# EAGLE design UI_breakout_slim (EAGLE 6.6.0)
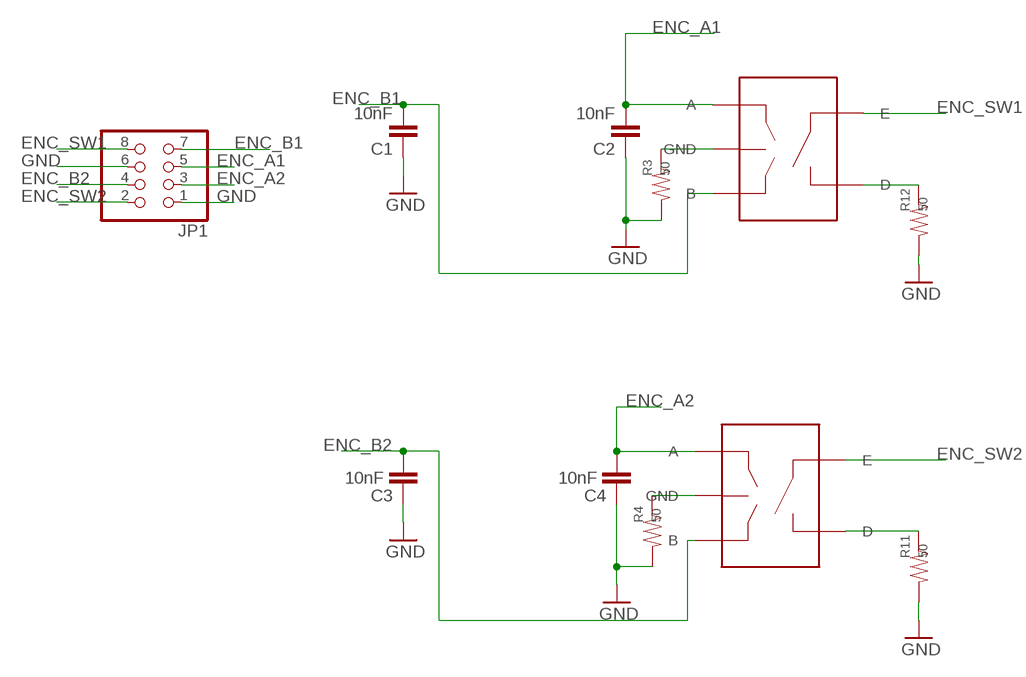
[diagram p0: schematic, sheet 1]

## Parts
C1  10nF  C-EUC0603  [C0603]
C2  10nF  C-EUC0603  [C0603]
C3  10nF  C-EUC0603  [C0603]
C4  10nF  C-EUC0603  [C0603]
ENC1  PEC09  [PEC092320FS]
ENC2  PEC09  [PEC092320FS]
JP1  PINHD-2X4-SHROUD  [ML08]
R3  50  RES0603  [0603]
R4  50  RES0603  [0603]
R11  50  RES0603  [0603]
R12  50  RES0603  [0603]

## Nets
C: ENC2.C(GND) R4.2
ENC_A1: C2.2 ENC1.A JP1.5
ENC_A2: C4.2 ENC2.A JP1.3
ENC_B1: C1.2 ENC1.B JP1.7
ENC_B2: C3.2 ENC2.B JP1.4
ENC_SW1: ENC1.E JP1.8
ENC_SW2: ENC2.E JP1.2
GND: C1.1 C2.1 C3.1 C4.1 JP1.1 JP1.6 R3.1 R4.1 R11.1 R12.1
N$3: ENC1.C(GND) R3.2
N$4: ENC2.D R11.2
N$5: ENC1.D R12.2

## Notes on the sheet
- ENC_A1
- ENC_B1
- ENC_SW1
- ENC_A2
- ENC_B2
- ENC_SW2

## Library data of the parts
C1-C4 = rcl:C-EU: CAPACITOR, European symbol
ENC1 ENC2 = connector-jqi:PEC09: PEC09-2320F-S0015 Rotary Encoder (Bourns).
JP1 = mcu-accessories:PINHD-2X4: PIN HEADER
R3 R4 R11 R12 = rlc-jqi:RES: SMT Resistor

## Board
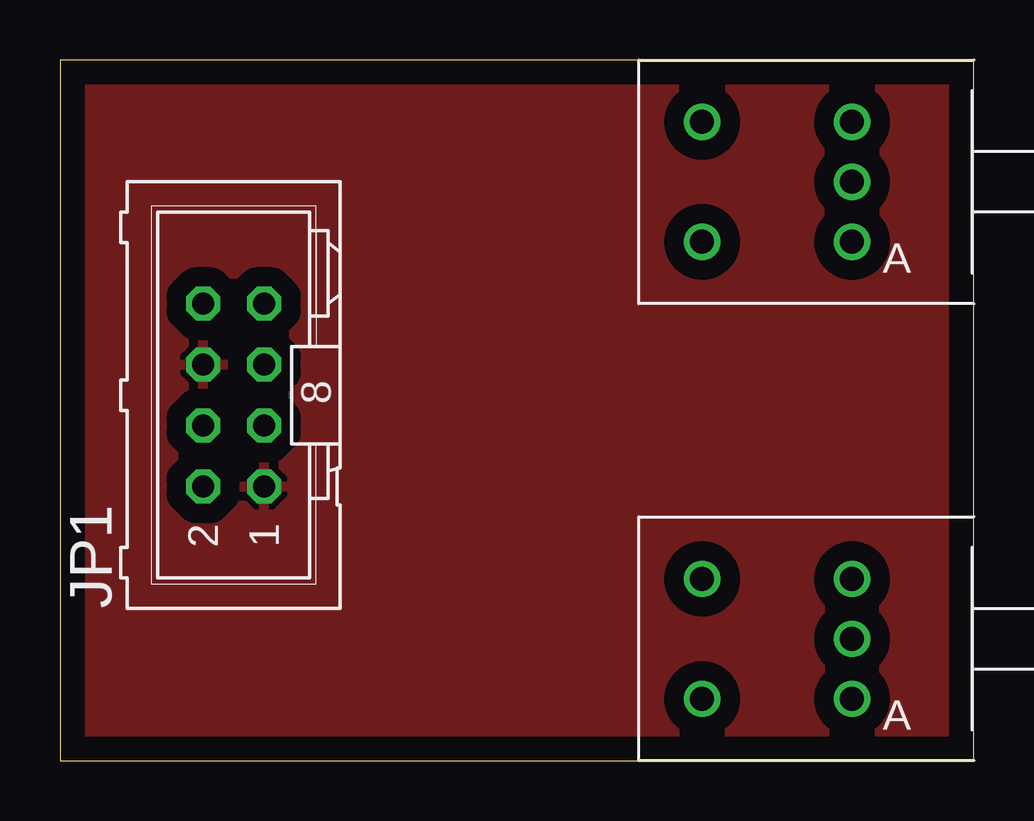
[diagram p1: board, top side]
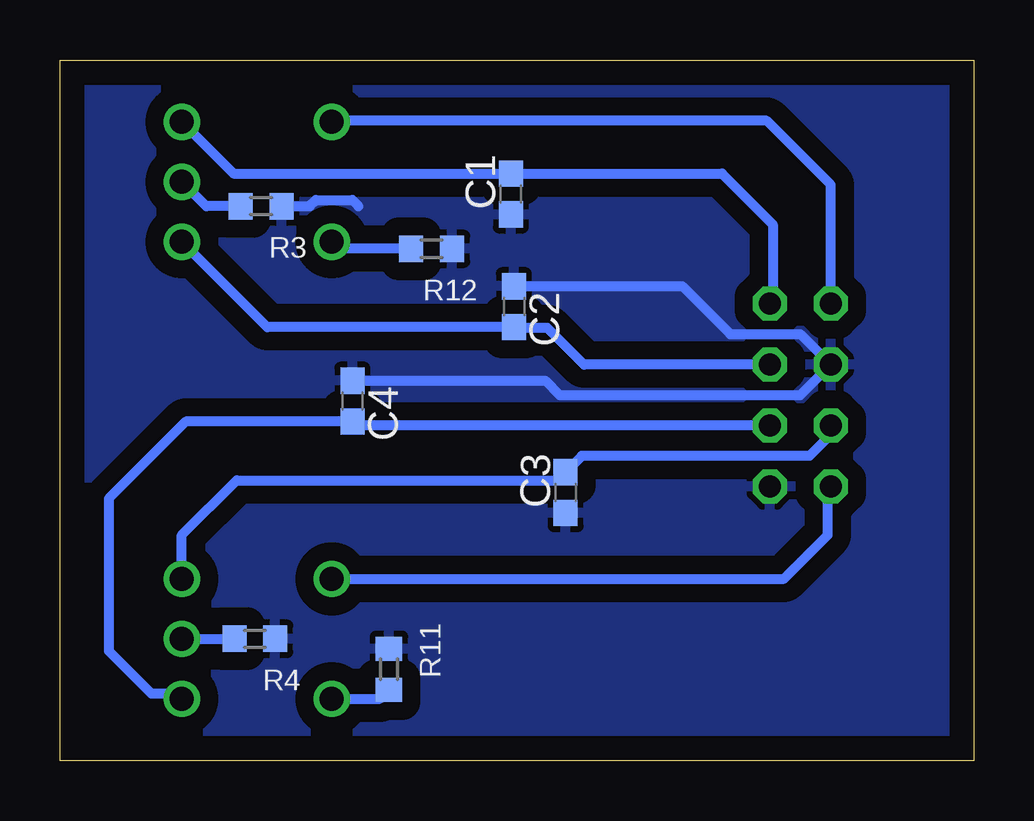
[diagram p2: board, bottom side, seen from below]

Size 38.1 x 29.21 mm. Coordinates in mm from the lower left corner, seen from the top.
Outline: 0,0 38.1,0 38.1,29.21 0,29.21 0,0
Copper layers (1*16): Top 0.035mm / dielectric 1.5mm / Bottom 0.035mm
Design rules "default": minimum track width 10mil, minimum drill 24mil, track to track 8mil, track to pad 8mil, pad to pad 8mil, via to via 8mil, smd to smd 8mil, copper to edge 40mil, drill to drill 8mil, minimum pad ring 10mil, minimum via ring 8mil, stop-mask expansion 4mil, vias tented up to drill 0mil, thermal gap 10mil

### Footprints (pad centres in the part's own frame; a part is rotated, then mirrored left to right if it is on the bottom)
C0603 = smd 1.1 x 1: 1 -0.85,0; 2 0.85,0
PEC092320FS = drill 1: A 0,-2.5; B 0,2.5; C 0,0; D -6.25,-2.5; E -6.25,2.5
ML08 = drill 0.914 octagon: 1 -3.81,-1.143; 2 -3.81,1.397; 3 -1.27,-1.143; 4 -1.27,1.397; 5 1.27,-1.143; 6 1.27,1.397; 7 3.81,-1.143; 8 3.81,1.397
0603 = smd 1 x 1.1: 1 -0.85,0; 2 0.85,0

### Placement (x,y rotation side)
C1  19.3,23.62 90 bottom
C2  19.18,18.92 270 bottom
C3  17.02,11.18 90 bottom
C4  25.91,14.99 270 bottom
ENC1  33.02,24.13 0 top
ENC2  33.02,5.08 0 top
JP1  7.37,15.24 90 top
R3  29.72,23.11 180 bottom
R4  29.97,5.08 180 bottom
R11  24.38,3.81 270 bottom
R12  22.61,21.34 180 bottom

### Tracks (layer width: path | path; a pad name or v marks a point on that pad's centre or on a via)
C
  Bottom 0.406: ENC2.C R4.2
ENC_A1
  Bottom 0.406: JP1.5 16.26,16.51 17.78,18.03 19.14,18.03 C2.2 29.46,18.07 ENC1.A
ENC_A2
  Bottom 0.406: JP1.3 25.74,13.97 C4.2 32.85,14.14 36.07,10.92 36.07,4.57 34.29,2.79 33.23,2.79 ENC2.A
ENC_B1
  Bottom 0.406: ENC1.B 30.86,24.47 C1.2 10.5,24.47 8.38,22.35 8.38,19.18 JP1.7
ENC_B2
  Bottom 0.406: JP1.4 5.97,13.59 6.86,12.7 16.34,12.7 C3.2 17.36,11.68 30.73,11.68 33.02,9.4 ENC2.B
ENC_SW1
  Bottom 0.406: JP1.8 5.97,24 8.64,26.67 26.73,26.67 ENC1.E
ENC_SW2
  Bottom 0.406: ENC2.E 7.91,7.58 6.1,9.4 6.1,11.3 JP1.2
GND
  Bottom 0.406: R3.1 27.69,23.11 27.43,23.37 25.91,23.37 25.65,23.11 | C2.1 12.15,19.77 10.16,17.78 7.24,17.78 JP1.6 7.24,15.24 17.27,15.24 17.87,15.84 C4.1
  pour Top (isolate 0.813): -2.54,30.73 -2.54,-2.29 40.64,-2.29 40.64,30.73
  pour Bottom (isolate 0.762): 0,29.21 38.1,29.21 38.1,0 0,0
N$3
  Bottom 0.406: R3.2 32,23.11 ENC1.C
N$4
  Bottom 0.406: ENC2.D 24.76,2.58 R11.2
N$5
  Bottom 0.406: R12.2 26.48,21.34 ENC1.D